# EasyEDA schematic SCH_Receiver-System_2026-04-16.json
TITLE: Sheet_1; REV: 1.0; Date: 2026-04-12; Sheet: 1/1; Drawn By: mendesdiego; Company: Your Company
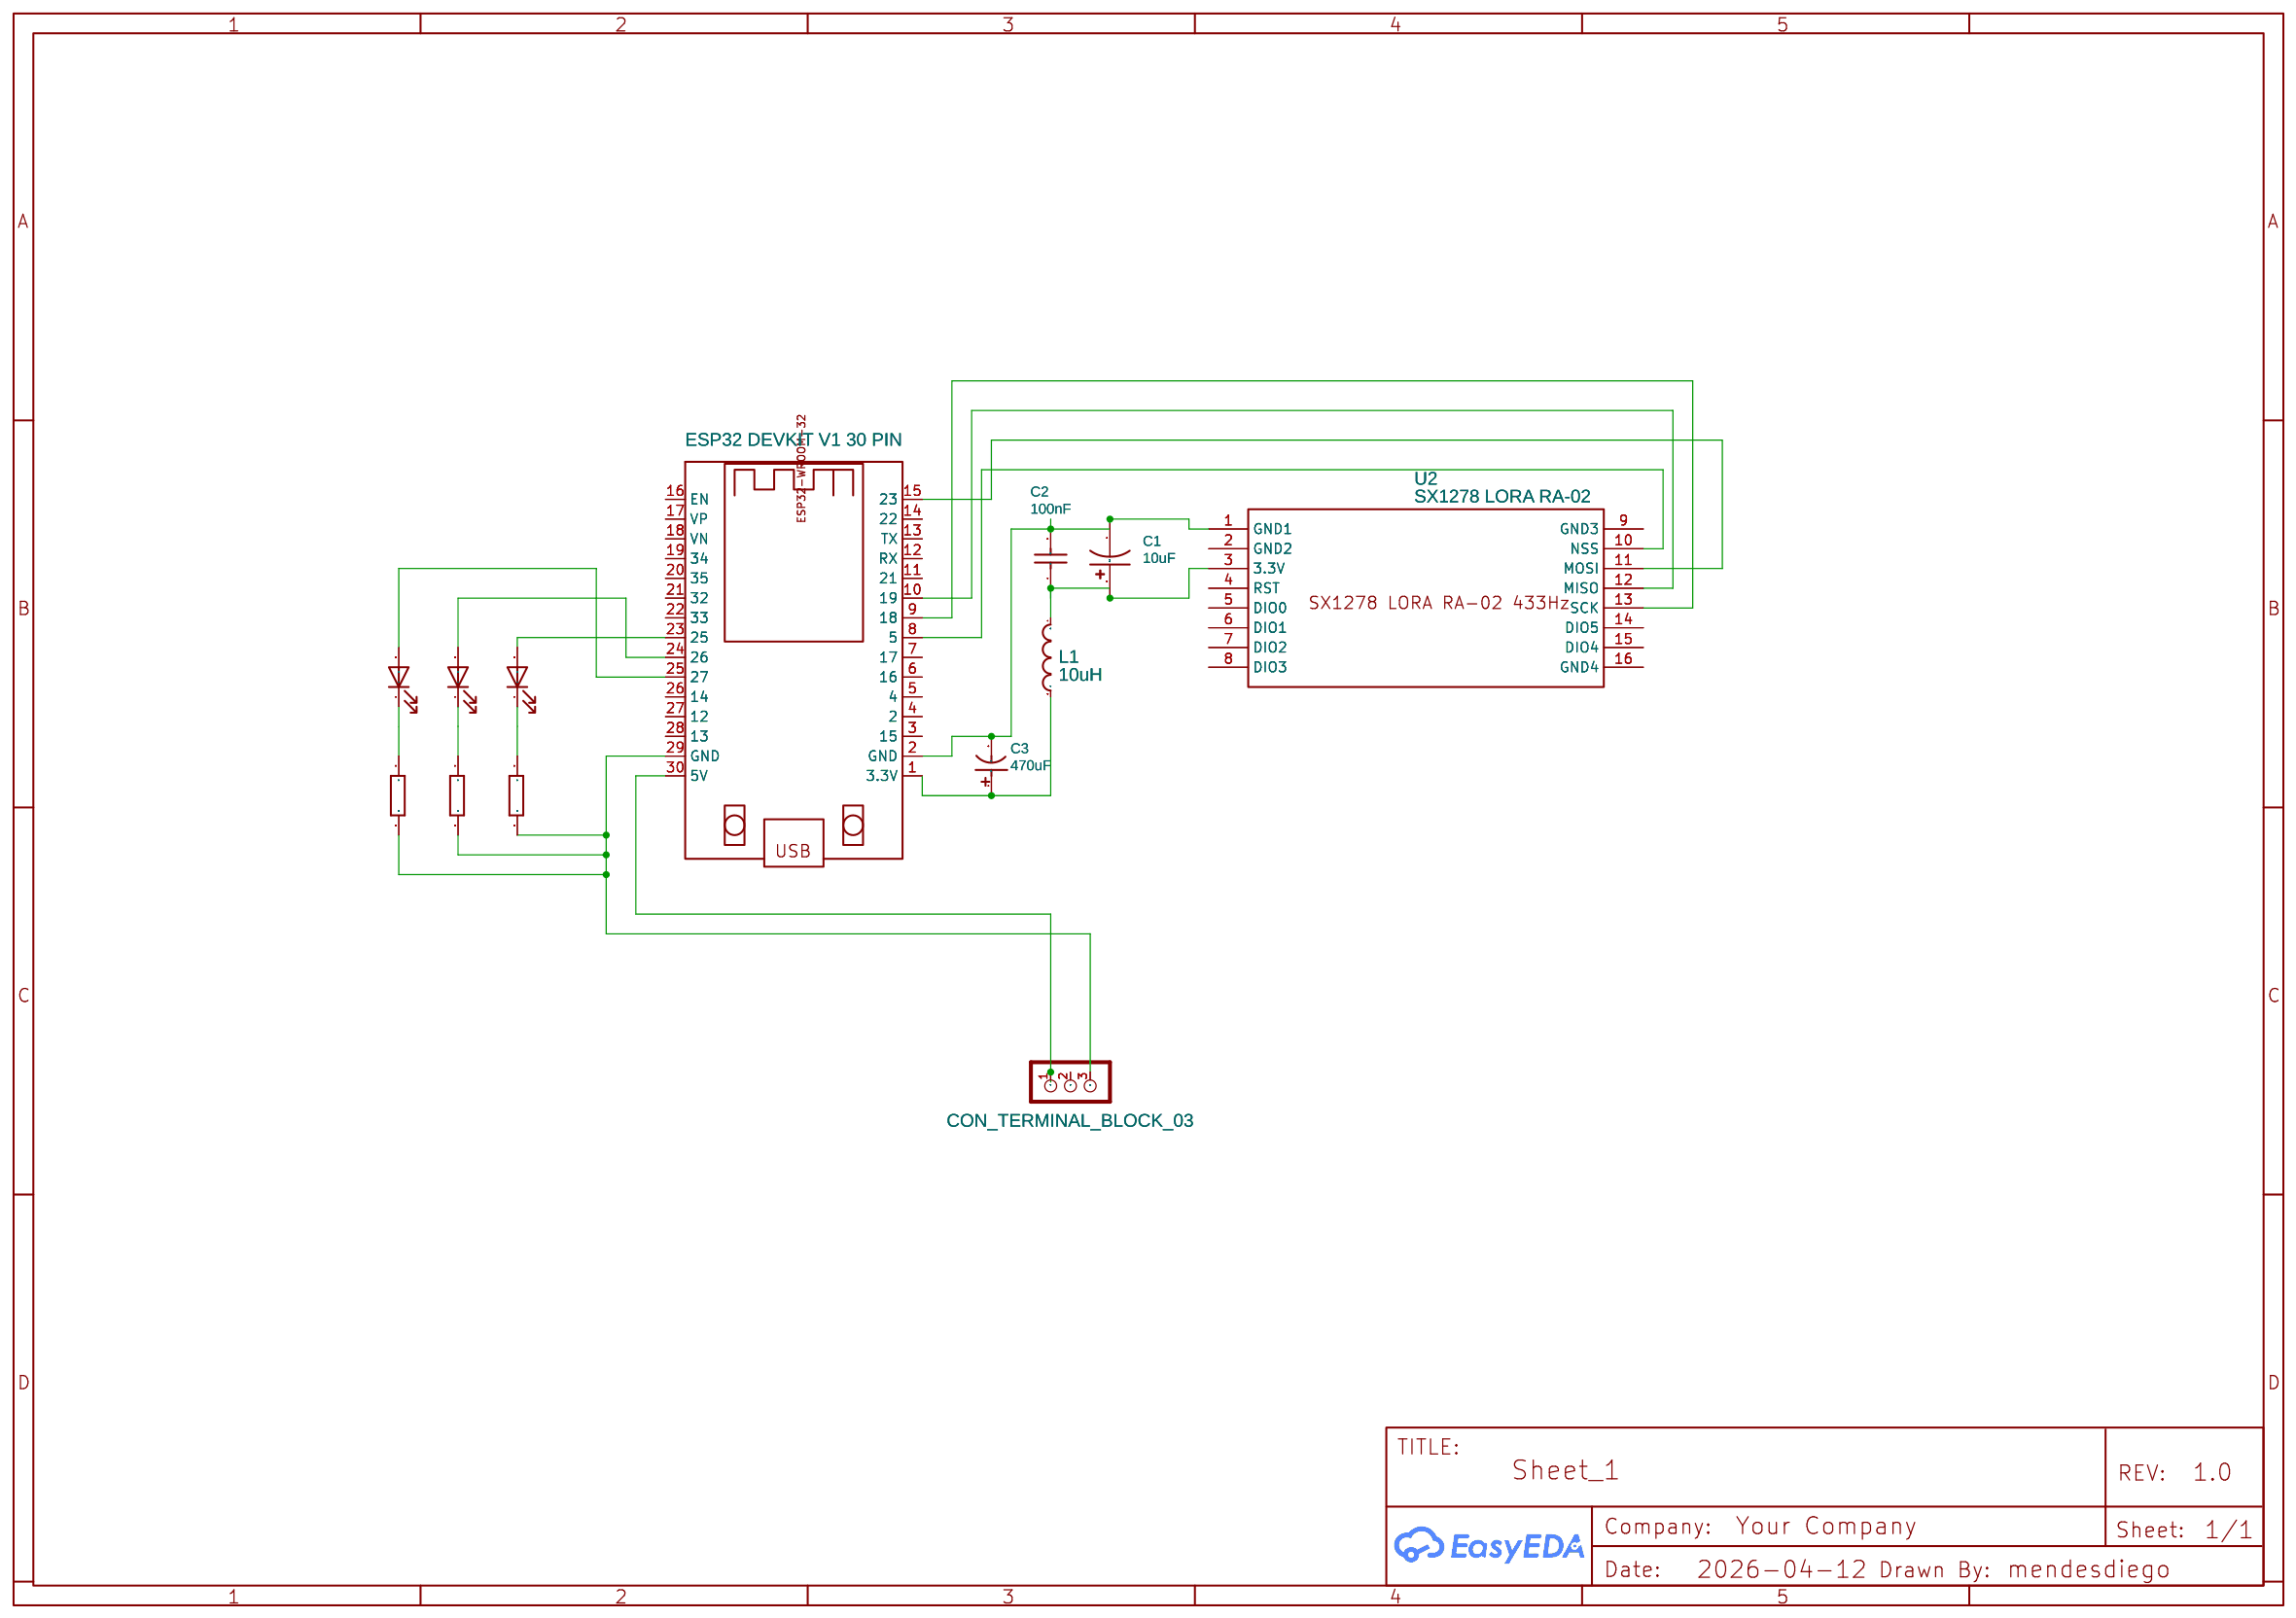
[diagram p0: schematic sheet]

## Parts
C1  10uF  [10UF-63V-3MM]
C2  100nF  [C100NF]
C3  470uF  [470UF/16V]
D1  LED THT  [LED_THT:LED_D5.0MM]
D2  LED THT  [LED_THT:LED_D5.0MM]
D3  LED THT  [LED_THT:LED_D5.0MM]
J1  CON_TERMINAL_BLOCK_03  [TERMINAL_BLOCK_3P_5]
L1  10uH  [10UH]
R1  RESISTOR-THT  [THT-RESISTOR]
R2  RESISTOR-THT  [THT-RESISTOR]
R4  RESISTOR-THT  [THT-RESISTOR]
U1  ESP32 DEVKIT V1 30 PIN  [ESP32 DEVKIT V1 30 PIN DEVBOARD]
U2  SX1278 LORA RA-02  [SX1278 LORA RA-02]

## Library data of the parts
C1 = 10UF 63V 5%-3mm: Contributor: Fuman Singh; Supplier: LCSC; Supplier Part: C5114620; Manufacturer: rubycon(红宝石); Manufacturer Part: 25MH510MEFCT55X5
C2 = C100NF: Supplier: LCSC; Manufacturer: ReliaPro; Manufacturer Part: Calibration capacitor100nF（104）100V,5%; Supplier Part: C26609; Contributor: nam.danghuu
C3 = Electrolytic 470uF 16V: Voltage: 25V; Supplier: EasyEDA; Contributor: R.M.Venkatraj
D1-D3 = LED THT: Symbol: Device_LED; Device: Device_LED; Add into BOM: yes; Convert to PCB: yes; Origin Footprint: LED_THT:LED_D5.0mm; Contributor: t.teenoom
J1 = CON_TERMINAL_BLOCK_03: Contributor: DangerousPrototype
L1 = 10uH: Manufacturer: ReliaPro; Manufacturer Part: General Inductor(TH)/10uH电感; Supplier Part: C27938; LCSC Assembly: Yes; SMT Type: Extend; Paste Type: expand; Contributor: ivanpenkov
R1 R2 R4 = RESISTOR-THT: Contributor: ethan.b.nicolaou
U1 = ESP32 DEVKIT V1 30 PIN DEVBOARD: Contributor: germanycsc
U2 = SX1278 LORA RA-02: Supplier: Onixo; Contributor: shapna.khatun1960

## Nets
Net-(C1-1): C1.1(2) C2.2 C3.2 U1.2(GND) U2.1(GND1)
Net-(C1-2): C1.2(1) C2.1 L1.4(2) U2.3(3.3V)
Net-(C3-1): C3.1 L1.3(1) U1.1(3.3V)
Net-(D1-1): D1.1(K) R4.2
Net-(D1-2): D1.2(A) U1.25(27)
Net-(D2-1): D2.1(K) R1.2
Net-(D2-2): D2.2(A) U1.24(26)
Net-(D3-1): D3.1(K) R2.2
Net-(D3-2): D3.2(A) U1.23(25)
Net-(J1-1): J1.1 U1.30(5V)
Net-(J1-3): J1.3 R1.1 R2.1 R4.1 U1.29(GND)
Net-(U1-8): U1.8(5) U2.10(NSS)
Net-(U1-9): U1.9(18) U2.13(SCK)
Net-(U1-10): U1.10(19) U2.12(MISO)
Net-(U1-15): U1.15(23) U2.11(MOSI)

Not connected (* = marked no-connect by the designer): J1 2; U1 3(15) 4(2) 5(4) 6(16) 7(17) 11(21) 12(RX) 13(TX) 14(22) 16(EN) 17(VP) 18(VN) 19(34) 20(35) 21(32) 22(33) 26(14) 27(12) 28(13); U2 2(GND2) 4(RST) 5(DIO0) 6(DIO1) 7(DIO2) 8(DIO3) 9(GND3) 14(DIO5) 15(DIO4) 16(GND4)
